# EAGLE design l298driver (EAGLE 6.5.0)
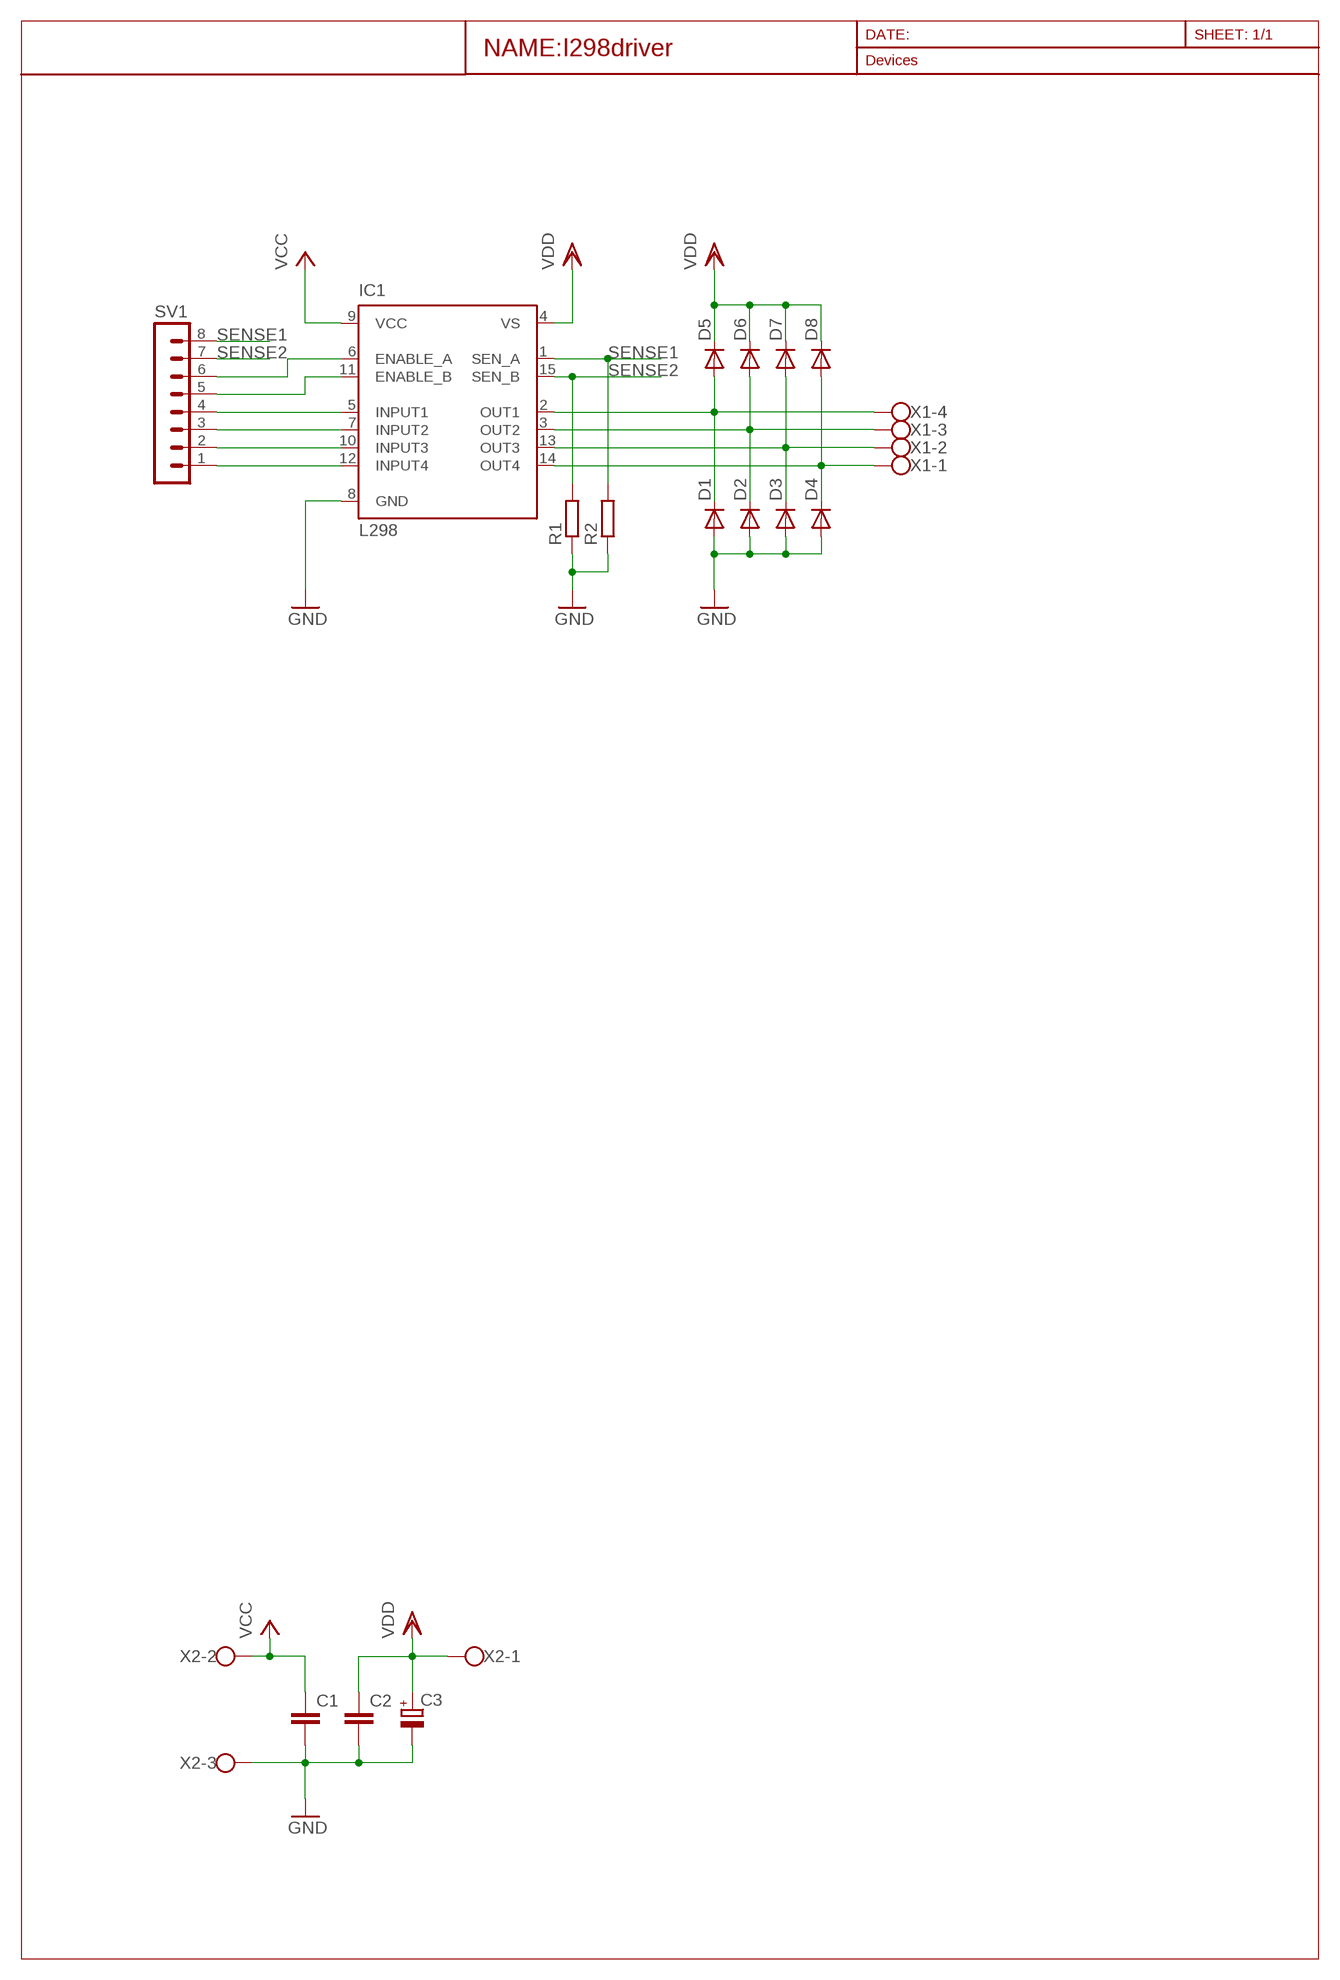
[diagram p0: schematic, sheet 1]

## Parts
C1  C-EU050-024X044  [C050-024X044]
C2  C-EU050-024X044  [C050-024X044]
C3  CPOL-EUE3.5-10  [E3,5-10]
D1  BA157  [P1-10]
D2  BA157  [P1-10]
D3  BA157  [P1-10]
D4  BA157  [P1-10]
D5  BA157  [P1-10]
D6  BA157  [P1-10]
D7  BA157  [P1-10]
D8  BA157  [P1-10]
IC1  L298  [MULTIWATT-15]
R1  R-EU_RDH/15  [RDH/15]
R2  R-EU_RDH/15  [RDH/15]
SV1  MA08-1  [MA08-1]
X1  W237-4  [W237-4]
X2  W237-103  [W237-103]

## Nets
GND: C1.2 C2.2 C3.- D1.A D2.A D3.A D4.A IC1.8(GND) R1.1 R2.1 X2.3
N$1: D1.C D5.A IC1.2(OUT1) X1.4
N$2: D2.C D6.A IC1.3(OUT2) X1.3
N$3: D3.C D7.A IC1.13(OUT3) X1.2
N$4: D4.C D8.A IC1.14(OUT4) X1.1
N$7: IC1.12(INPUT4) SV1.1
N$8: IC1.10(INPUT3) SV1.2
N$9: IC1.7(INPUT2) SV1.3
N$10: IC1.5(INPUT1) SV1.4
N$11: IC1.11(ENABLE_B) SV1.5
N$12: IC1.6(ENABLE_A) SV1.6
SENSE1: IC1.1(SEN_A) R2.2 SV1.8
SENSE2: IC1.15(SEN_B) R1.2 SV1.7
VCC: C1.1 IC1.9(VCC) X2.2
VDD: C2.1 C3.+ D5.C D6.C D7.C D8.C IC1.4(VS) X2.1

## Library data of the parts
C1 C2 = rcl:C-EU: CAPACITOR, European symbol
C3 = rcl:CPOL-EU: POLARIZED CAPACITOR, European symbol
D1-D8 = diode:BA157: DIODE fast soft-recovery controlled avalanche rectifier
IC1 = st-microelectronics:L298: DUAL FULL-BRIDGE DRIVER; MPN: L298N; OC_FARNELL: 1589425; OC_NEWARK: 32M1527
R1 R2 = rcl:R-EU_: RESISTOR, European symbol
SV1 = con-lstb:MA08-1: PIN HEADER; OC_FARNELL: unknown; OC_NEWARK: unknown
X1 = con-wago-500:W237-4: WAGO SCREW CLAMP; OC_FARNELL: unknown; OC_NEWARK: unknown
X2 = con-wago-500:W237-103: WAGO SCREW CLAMP; MPN: 237-103; OC_FARNELL: unknown; OC_NEWARK: 18M7116

## Board
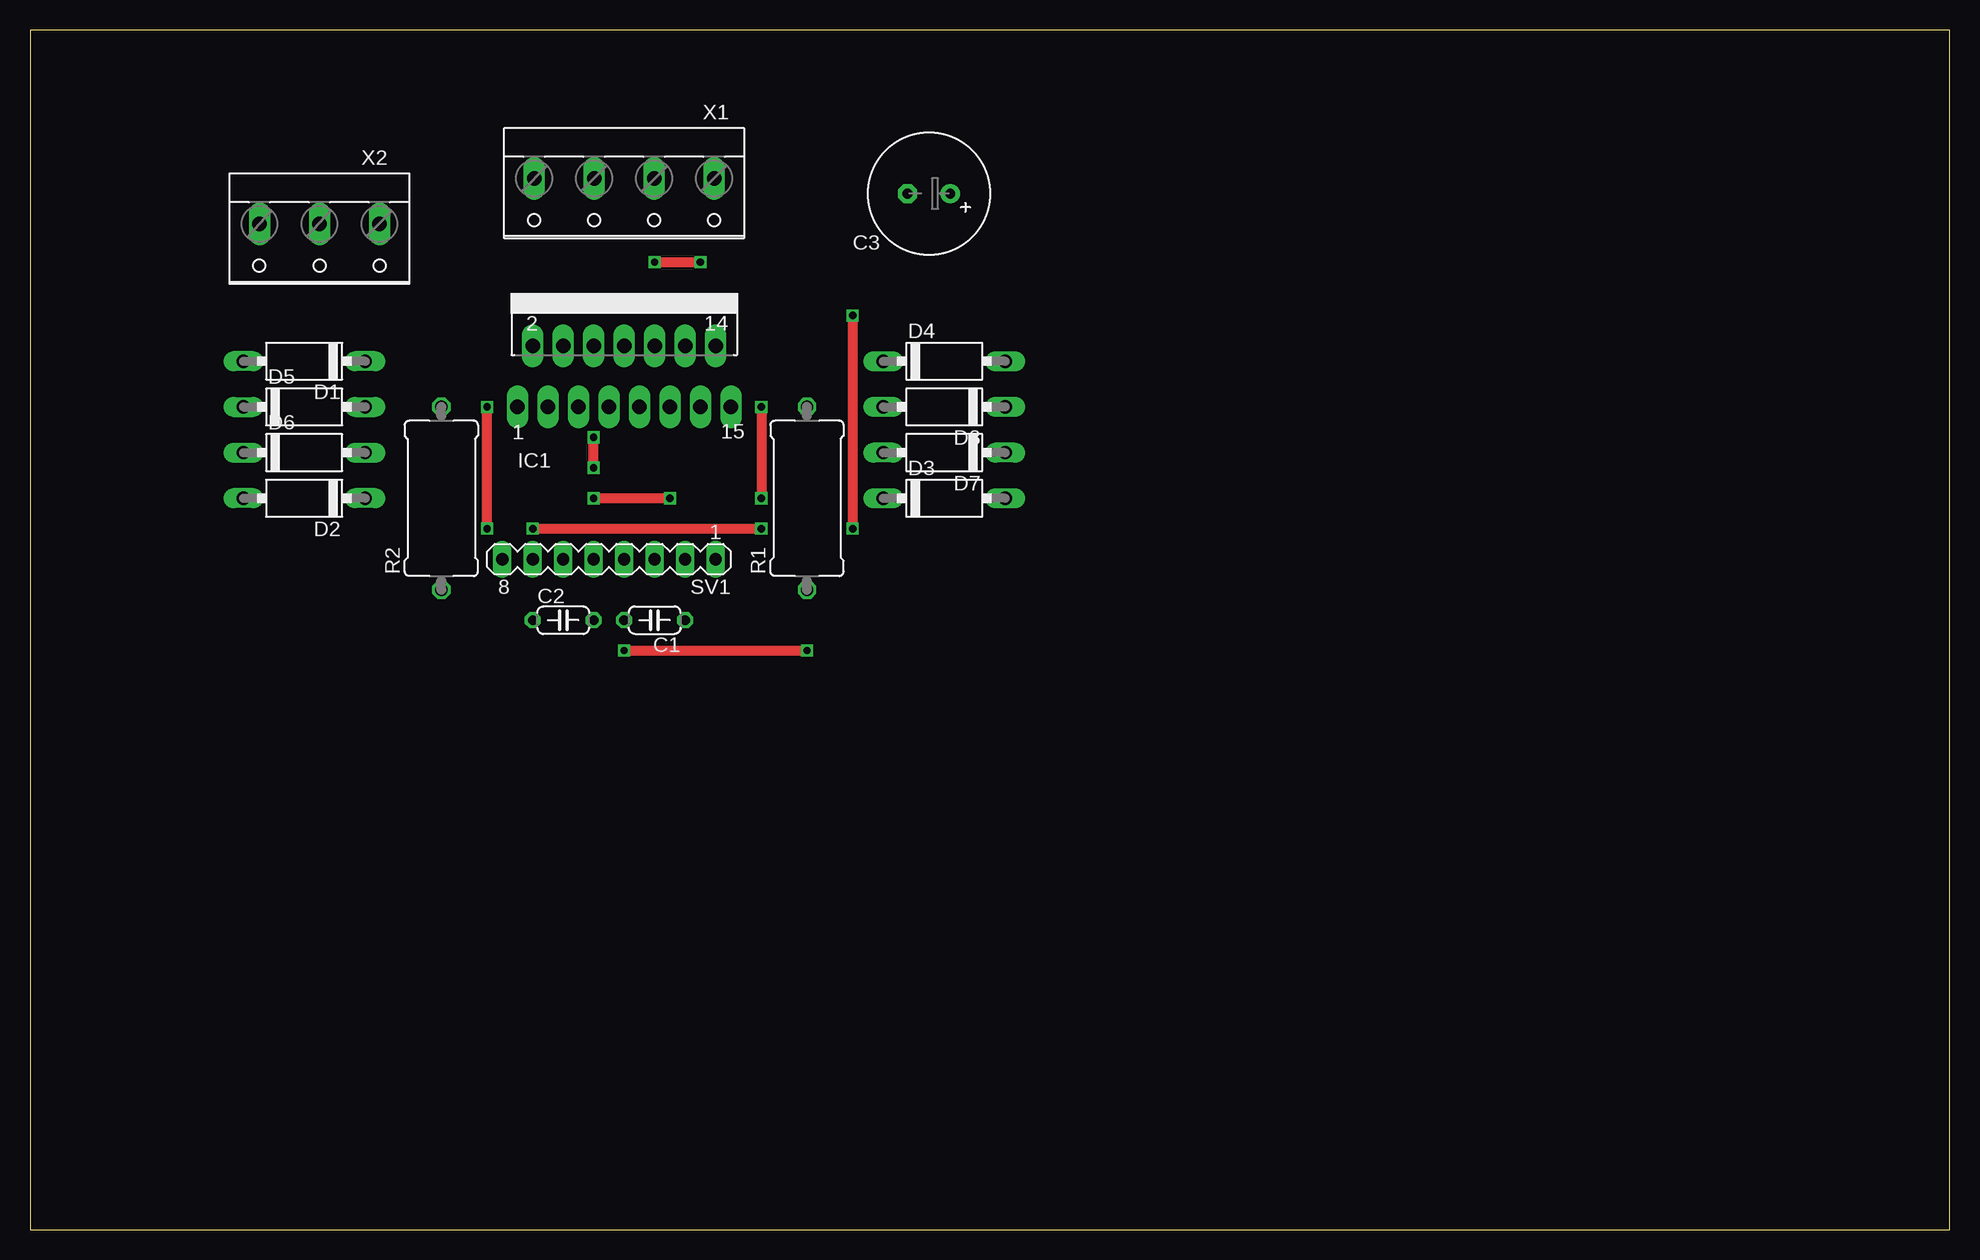
[diagram p1: board, top side]
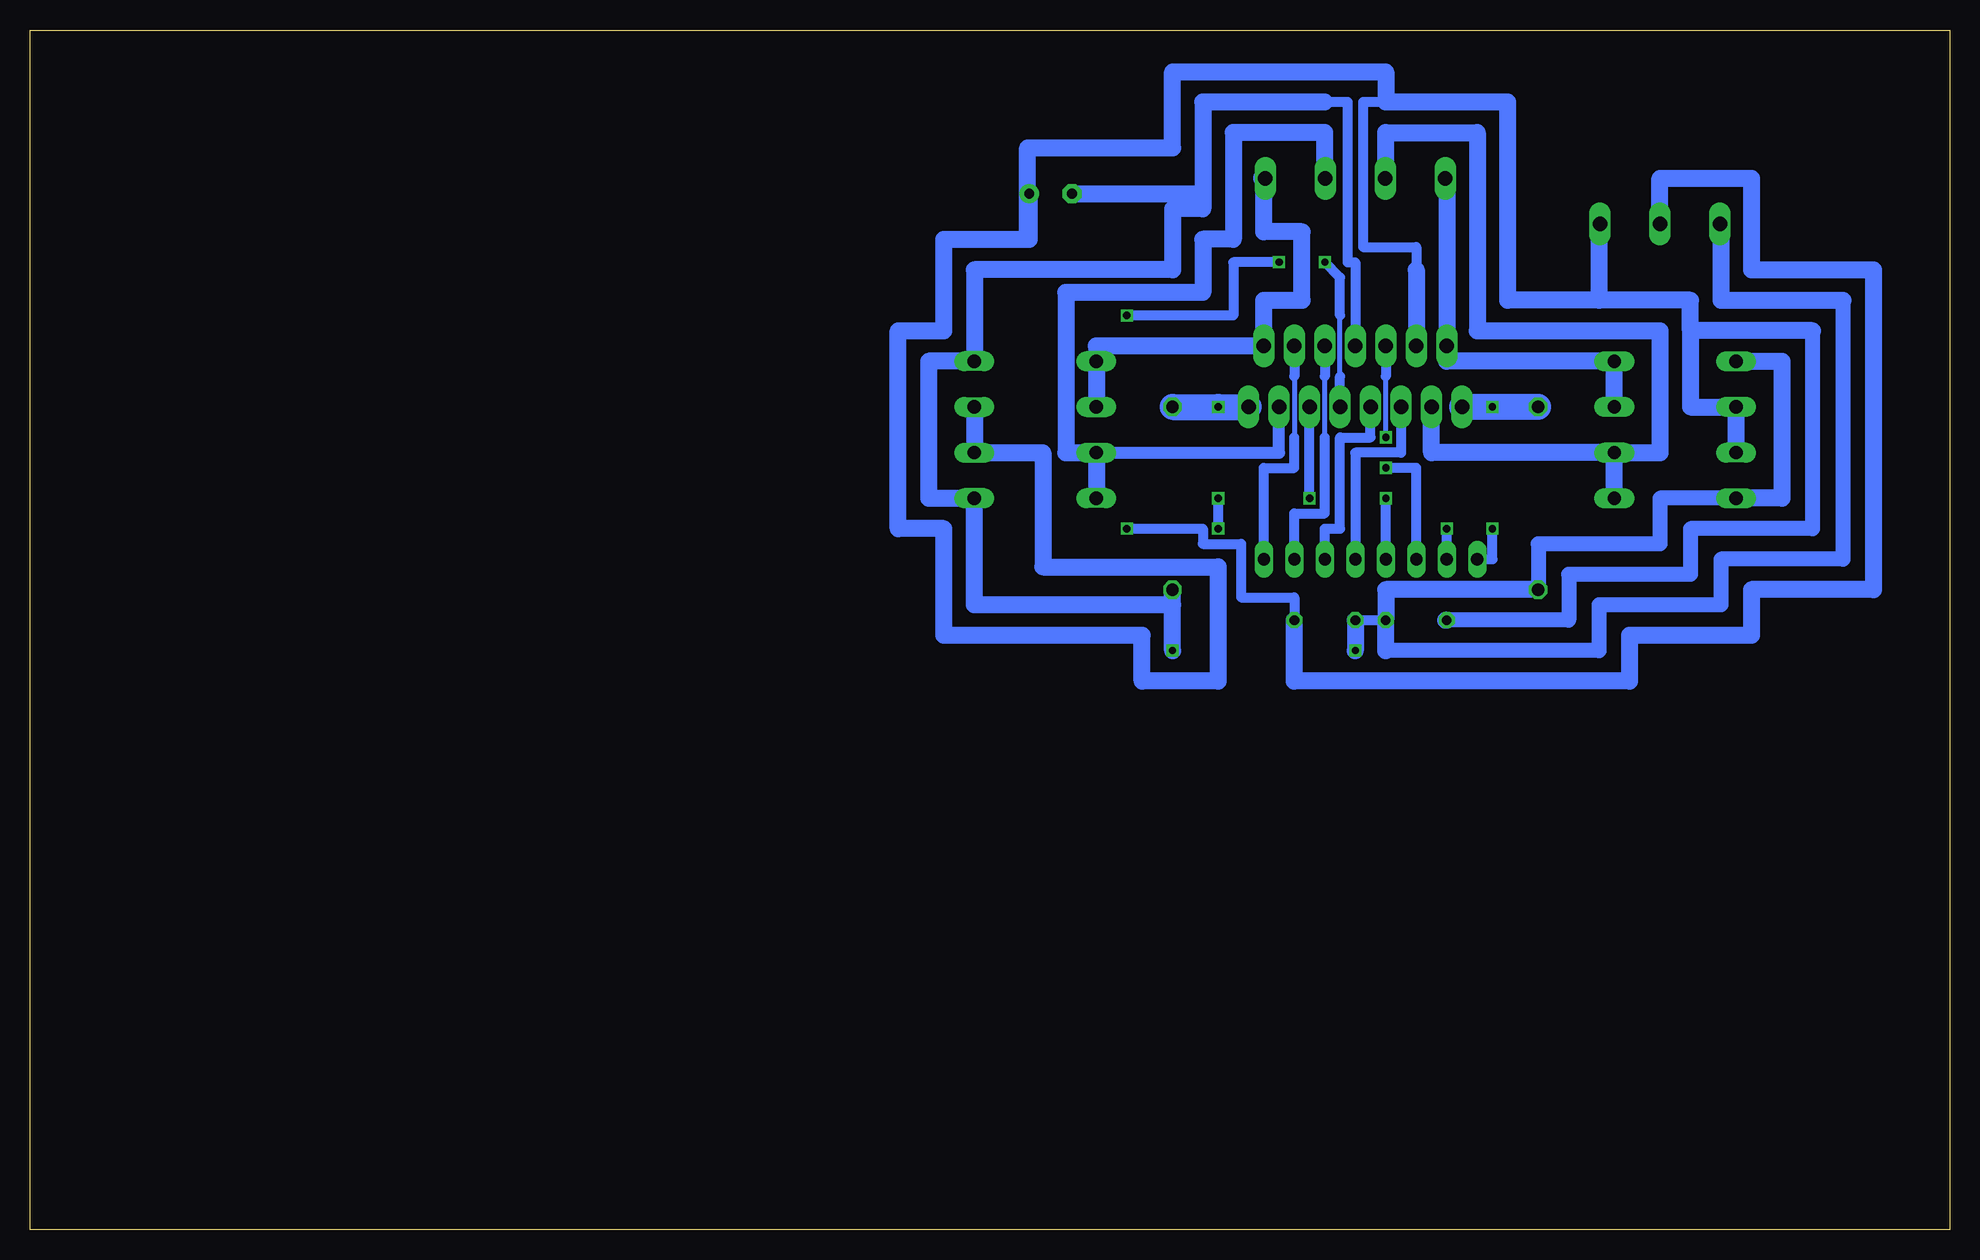
[diagram p2: board, bottom side, seen from below]

Size 160 x 100 mm. Coordinates in mm from the lower left corner, seen from the top.
Outline: 0,0 160,0 160,100 0,100 0,0
Copper layers (1*16): Top 0.035mm / dielectric 1.5mm / Bottom 0.035mm
Design rules "default": minimum track width 10mil, minimum drill 24mil, track to track 8mil, track to pad 8mil, pad to pad 8mil, via to via 8mil, smd to smd 8mil, copper to edge 40mil, drill to drill 8mil, minimum pad ring 10mil, minimum via ring 8mil, stop-mask expansion 4mil, vias tented up to drill 0mil, thermal gap 10mil

### Footprints (pad centres in the part's own frame; a part is rotated, then mirrored left to right if it is on the bottom)
C050-024X044 = drill 0.813 octagon: 1 -2.54,0; 2 2.54,0
E3,5-10 = drill 0.813 pad 1.6: + -1.778,0 | drill 0.813 pad 1.6 octagon: - 1.778,0
P1-10 = drill 1.118 long: A 5.08,0; C -5.08,0
MULTIWATT-15 = drill 1.2 long: 1 -8.89,-7.62; 2 -7.62,-2.54; 3 -6.35,-7.62; 4 -5.08,-2.54; 5 -3.81,-7.62; 6 -2.54,-2.54; 7 -1.27,-7.62; 8 0,-2.54; 9 1.27,-7.62; 10 2.54,-2.54; 11 3.81,-7.62; 12 5.08,-2.54; 13 6.35,-7.62; 14 7.62,-2.54; 15 8.89,-7.62
RDH/15 = drill 1.016 octagon: 1 -7.62,0; 2 7.62,0
MA08-1 = drill 1.016 long: 1 -8.89,0; 2 -6.35,0; 3 -3.81,0; 4 -1.27,0; 5 1.27,0; 6 3.81,0; 7 6.35,0; 8 8.89,0
W237-4 = drill 1.194 long: 1 -7.5,-1.27; 2 -2.5,-1.27; 3 2.5,-1.27; 4 7.5,-1.27
W237-103 = drill 1.194 long: 1 -5,-1.29; 2 0,-1.29; 3 5,-1.29

### Placement (x,y rotation side)
C1  52.07,50.8 180 top
C2  44.45,50.8 0 top
C3  74.93,86.36 180 top
D1  22.86,72.39 180 top
D2  22.86,60.96 180 top
D3  76.2,60.96 0 top
D4  76.2,72.39 0 top
D5  22.86,68.58 0 top
D6  22.86,64.77 0 top
D7  76.2,64.77 180 top
D8  76.2,68.58 180 top
IC1  49.53,76.2 0 top
R1  64.77,60.96 90 top
R2  34.29,60.96 90 top
SV1  48.26,55.88 180 top
X1  49.53,86.36 180 top
X2  24.13,82.55 180 top

### Tracks (layer width: path | path; a pad name or v marks a point on that pad's centre or on a via)
GND  (via drill 0.6)
  Top 0.813: v49.53,48.26 v64.77,48.26
  Bottom 0.813: C1.2 C2.2 | 52.07,93.98 50.16,93.98 50.16,80.64 49.53,80.64 IC1.8
  Bottom 1.27: 13.97,60.96 24.13,60.96 24.13,57.15 34.29,57.15 R2.1 | 8.89,77.47 8.89,55.88 19.05,55.88 19.05,52.07 29.21,52.07 29.21,48.26 46.99,48.26
  Bottom 1.422: 52.07,93.98 62.23,93.98 62.23,86.36 | D1.A 13.97,72.39 13.97,60.96 D2.A | 64.77,52.07 81.28,52.07 D3.A 85.09,60.96 85.09,72.39 D4.A 81.28,80.01 64.77,80.01 64.77,85.09 62.23,85.09 62.23,86.36 | R2.1 46.99,53.34 C2.2 46.99,48.26 | C1.2 v49.53,48.26 | v64.77,48.26 64.77,52.07 | 64.77,52.07 R1.1 | C3.- 62.23,86.36 | X2.3 19.05,83.84 19.05,77.47 8.89,77.47
N$1
  Bottom 1.422: X1.4 41.91,87.63 IC1.2 41.91,72.39 D1.C D5.A
N$2
  Bottom 1.422: IC1.3 43.18,64.77 D6.A | X1.3 46.99,87.63 46.99,91.44 39.37,91.44 39.37,74.93 24.13,74.93 24.13,64.77 D6.A | D2.C D6.A
N$3
  Bottom 1.016: D7.A 55.88,64.77 IC1.13
  Bottom 1.422: X1.2 52.07,87.63 52.07,91.44 59.69,91.44 59.69,82.55 62.23,82.55 62.23,78.11 73.66,78.11 73.66,64.77 D7.A D3.C
N$4
  Bottom 1.422: X1.1 57.03,86.36 57.15,86.36 57.15,83.19 53.98,83.19 53.98,77.47 57.15,77.47 IC1.14 71.12,73.66 D4.C D8.A
  Bottom 1.778: X1.1 57.15,87.63
N$7
  Bottom 0.406: 54.61,71.12 54.61,66.04
  Bottom 0.813: SV1.1 57.15,63.5 54.61,63.5 54.61,66.04 | IC1.12 54.61,71.12
N$8
  Bottom 0.406: 52.07,66.04 52.07,71.12
  Bottom 0.813: IC1.10 52.07,71.12 | SV1.2 54.61,59.69 52.07,59.69 52.07,66.04
N$9
  Bottom 0.813: SV1.3 52.07,58.42 50.8,58.42 50.8,66.04 48.26,66.04 IC1.7
N$10
  Bottom 0.813: IC1.5 45.72,64.77 49.53,64.77 SV1.4
N$11  (via drill 0.6)
  Top 0.813: v46.99,60.96 v53.34,60.96
  Bottom 0.813: SV1.5 v46.99,60.96 | v53.34,60.96 IC1.11
N$12  (via drill 0.6)
  Top 0.813: v46.99,63.5 v46.99,66.04
  Bottom 0.406: v46.99,66.04 46.99,71.12
  Bottom 0.813: IC1.6 46.99,71.12 | SV1.6 44.45,63.5 v46.99,63.5
SENSE1  (via drill 0.6)
  Top 0.813: v38.1,58.42 v38.1,68.58
  Bottom 0.813: SV1.8 38.1,55.88 v38.1,58.42
  Bottom 2.184: R2.2 v38.1,68.58 IC1.1
SENSE2  (via drill 0.6)
  Top 0.813: v60.96,68.58 v60.96,60.96 | v41.91,58.42 v60.96,58.42
  Bottom 0.813: v60.96,60.96 v60.96,58.42 | SV1.7 v41.91,58.42
  Bottom 2.184: R1.2 v60.96,68.58 IC1.15
VCC  (via drill 0.6)
  Top 0.813: v52.07,80.64 v55.88,80.64 | v68.58,76.2 v68.58,58.42
  Bottom 0.406: 50.8,71.12 50.8,76.2
  Bottom 0.813: IC1.9 50.8,71.12 | 50.8,76.2 50.8,79.38 v52.07,80.64 | v68.58,58.42 62.23,58.42 62.23,57.15 59.05,57.15 59.05,52.7 54.61,52.7 C1.1 | v55.88,80.64 59.69,80.64 59.69,76.2 v68.58,76.2
  Bottom 1.422: C1.1 54.61,45.72 26.67,45.72 26.67,49.53 16.51,49.53 16.51,53.34 6.35,53.34 6.35,80.01 16.51,80.01 16.51,87.63 24.13,87.63 X2.2
VDD
  Bottom 0.813: 44.45,80.01 44.45,81.92 48.9,81.92 48.9,93.98 46.99,93.98
  Bottom 1.27: 11.43,74.93 11.43,58.42 21.59,58.42 21.59,54.61 31.75,54.61 31.75,50.8 C2.1
  Bottom 1.422: C2.1 41.99,50.8 | 29.21,77.47 21.59,77.47 21.59,74.93 | 29.21,77.47 36.83,77.47 36.83,93.98 46.99,93.98 46.99,96.52 64.77,96.52 64.77,90.17 76.83,90.17 76.83,82.55 | 44.45,80.01 IC1.4 | D6.C D5.C 21.59,68.58 21.59,74.93 | 76.83,82.55 76.71,82.55 C3.+ | D8.C D7.C 75.56,64.77 75.56,55.24 60.96,55.24 60.96,45.72 67.31,45.72 67.31,49.53 83.82,49.53 83.82,58.42 87.63,58.42 87.63,74.93 83.82,74.93 83.82,82.55 76.83,82.55 | 11.43,74.93 21.59,74.93 | X2.1 29.21,83.84 29.21,77.47